# Altium schematic sheet Telemetry.SchDoc
size B; SheetNumber: 4; SheetTotal: 8
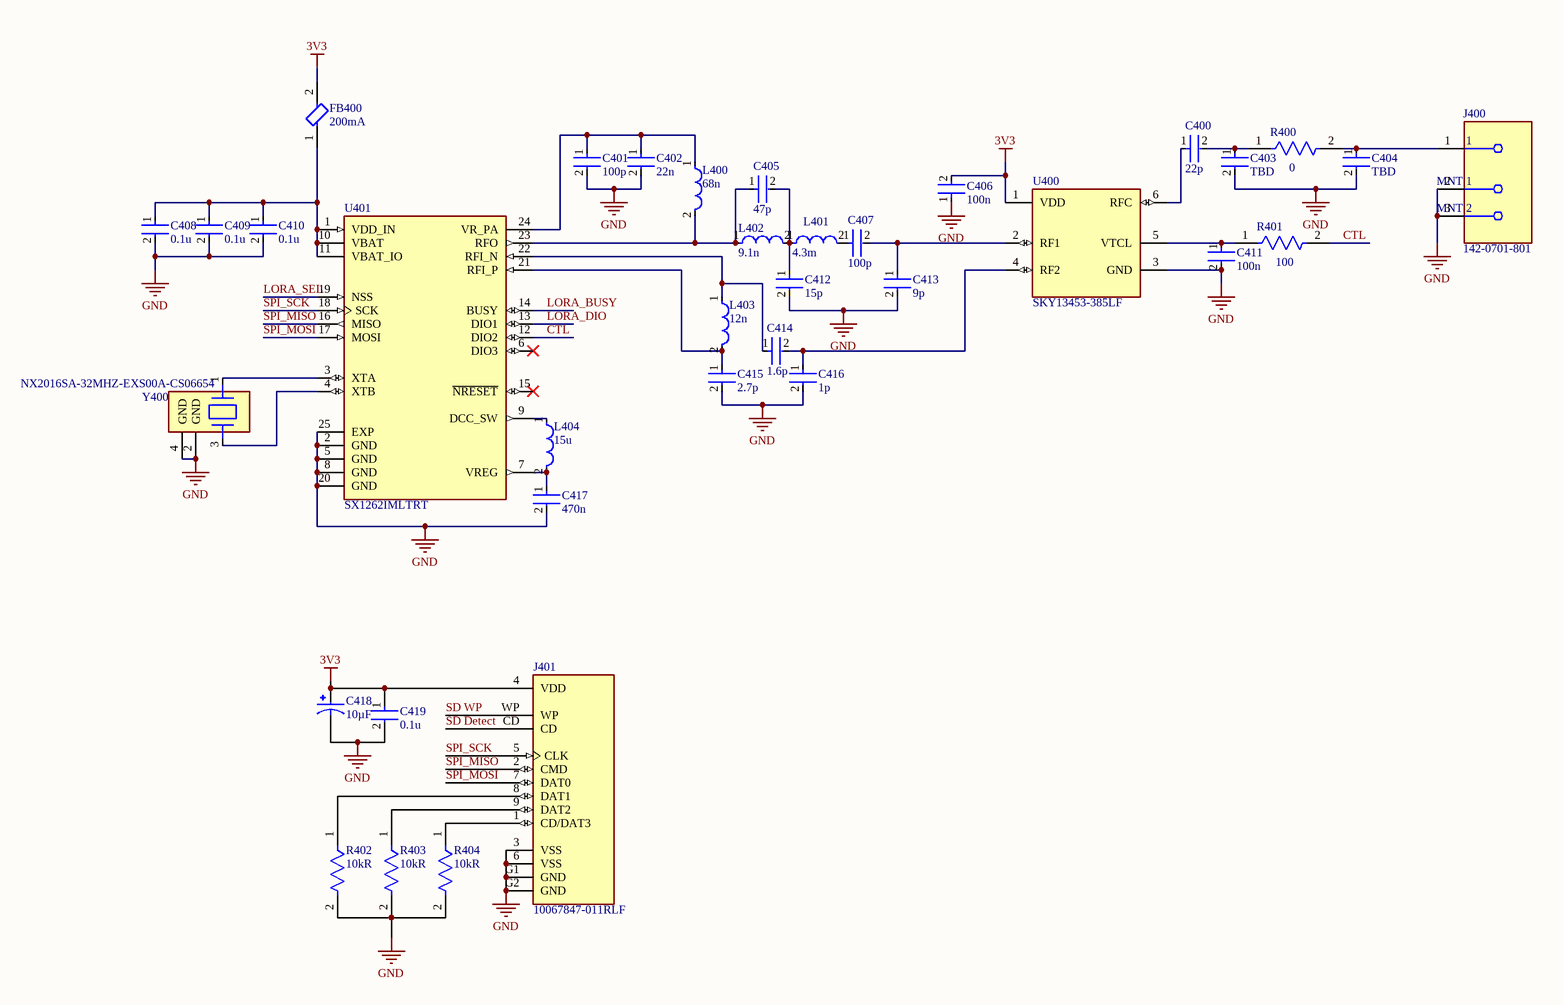
[diagram p0: Telemetry.SchDoc]

## Parts
C400  Capacitance: 22p  [FP-CL10-IPC_A]  (hidden comment: CL10C681JB8NFNC)
C401  Capacitance: 100p  [FP-CL10-IPC_A]  (hidden comment: CL10C681JB8NFNC)
C402  Capacitance: 22n  [FP-CL10-IPC_A]  (hidden comment: CL10C681JB8NFNC)
C403  Capacitance: TBD  [FP-CL10-IPC_A]  (hidden comment: CL10C681JB8NFNC)
C404  Capacitance: TBD  [FP-CL10-IPC_A]  (hidden comment: CL10C681JB8NFNC)
C405  Capacitance: 47p  [FP-CL10-IPC_A]  (hidden comment: CL10C681JB8NFNC)
C406  Capacitance: 100n  [FP-CL10-IPC_A]  (hidden comment: CL10C681JB8NFNC)
C407  Capacitance: 100p  [FP-CL10-IPC_A]  (hidden comment: CL10C681JB8NFNC)
C408  Capacitance: 0.1u  [FP-CL10-IPC_A]  (hidden comment: CL10C681JB8NFNC)
C409  Capacitance: 0.1u  [FP-CL10-IPC_A]  (hidden comment: CL10C681JB8NFNC)
C410  Capacitance: 0.1u  [FP-CL10-IPC_A]  (hidden comment: CL10C681JB8NFNC)
C411  Capacitance: 100n  [FP-CL10-IPC_A]  (hidden comment: CL10C681JB8NFNC)
C412  Capacitance: 15p  [FP-CL10-IPC_A]  (hidden comment: CL10C681JB8NFNC)
C413  Capacitance: 9p  [FP-CL10-IPC_A]  (hidden comment: CL10C681JB8NFNC)
C414  Capacitance: 1.6p  [FP-CL10-IPC_A]  (hidden comment: CL10C681JB8NFNC)
C415  Capacitance: 2.7p  [FP-CL10-IPC_A]  (hidden comment: CL10C681JB8NFNC)
C416  Capacitance: 1p  [FP-CL10-IPC_A]  (hidden comment: CL10C681JB8NFNC)
C417  Capacitance: 470n  [FP-CL10-IPC_A]  (hidden comment: CL10C681JB8NFNC)
C418  value 10µF  [CAP_EEEFN1C100R]  (hidden comment: EEEFN1C100R)
C419  Capacitance: 0.1u  [FP-CL10-IPC_A]  (hidden comment: CL10C681JB8NFNC)
FB400  200mA  [FP-BLM18-0_15-t0_8-IPC_B]
J400  142-0701-801  [FP-142-0701-801-MFG]
J401  10067847-011RLF  [AMPHENOL_10067847-011RLF]
L400  68n  [FP-LQM18NN_00-IPC_B]
L401  4.3m  [FP-LQM18NN_00-IPC_B]
L402  9.1n  [FP-LQM18NN_00-IPC_B]
L403  12n  [FP-LQM18NN_00-IPC_B]
L404  15u  [FP-LQM18NN_00-IPC_B]
R400  value 0  [FP-CPF0603-MFG]  (hidden comment: CPF0603B2K15E1)
R401  value 100  [FP-CPF0603-MFG]  (hidden comment: CPF0603B2K15E1)
R402  value 10kR  [FP-CPF0603-MFG]  (hidden comment: CPF0603B2K15E1)
R403  value 10kR  [FP-CPF0603-MFG]  (hidden comment: CPF0603B2K15E1)
R404  value 10kR  [FP-CPF0603-MFG]  (hidden comment: CPF0603B2K15E1)
U400  SKY13453-385LF  [IC_SKY13453-385LF]
U401  SX1262IMLTRT  [QFN50P400X400X100-25N]
Y400  NX2016SA-32MHZ-EXS00A-CS06654  [FP-NX2016SA-MFG]

## Nets
3V3: C406.2 C418.1 C419.1 FB400.2 J401.4(VDD) U400.1(VDD)
GND: C401.2 C402.2 C403.2 C404.2 C406.1 C408.2 C409.2 C410.2 C411.2 C412.2 C413.2 C415.2 C416.2 C417.2 C418.2 C419.2 J400.2(MNT_1) J400.3(MNT_2) J401.3(VSS) J401.6(VSS) J401.G1(GND) J401.G2(GND) R402.2 R403.2 R404.2 U400.3(GND) U401.2(GND) U401.5(GND) U401.8(GND) U401.20(GND) U401.25(EXP) Y400.2(GND) Y400.4(GND)
CTL: R401.2 U401.12(DIO2)
LORA_BUSY: U401.14(BUSY)
LORA_DIO: U401.13(DIO1)
LORA_SEL: U401.19(NSS)
SD Detect: J401.CD
SD WP: J401.WP
SPI_MISO: J401.2(CMD) U401.16(MISO)
SPI_MOSI: J401.7(DAT0) U401.17(MOSI)
SPI_SCK: J401.5(CLK) U401.18(SCK)
NetC400_1: C400.1 U400.6(RFC)
NetC400_2: C400.2 C403.1 R400.1
NetC401_1: C401.1 C402.1 L400.1 U401.24(VR_PA)
NetC404_1: C404.1 J400.1 R400.2
NetC405_1: C405.1 L400.2 L402.1 U401.23(RFO)
NetC405_2: C405.2 C412.1 L401.1 L402.2
NetC407_1: C407.1 L401.2
NetC407_2: C407.2 C413.1 U400.2(RF1)
NetC408_1: C408.1 C409.1 C410.1 FB400.1 U401.1(VDD_IN) U401.10(VBAT) U401.11(VBAT_IO)
NetC411_1: C411.1 R401.1 U400.5(VTCL)
NetC414_1: C414.1 L403.1 U401.22(RFI_N)
NetC414_2: C414.2 C416.1 U400.4(RF2)
NetC415_1: C415.1 L403.2 U401.21(RFI_P)
NetC417_1: C417.1 L404.2 U401.7(VREG)
NetJ401_1: J401.1(CD/DAT3) R404.1
NetJ401_8: J401.8(DAT1) R402.1
NetJ401_9: J401.9(DAT2) R403.1
NetL404_1: L404.1 U401.9(DCC_SW)
NetU401_3: U401.3(XTA) Y400.1
NetU401_4: U401.4(XTB) Y400.3

Not connected (* = marked no-connect by the designer): U401 6(DIO3)* 15(~{NRESET})*

## Library data of the parts
C400-C417 C419 = CMP-13271-001533-1: Cap Ceramic 680pF 50V C0G ±5% Pad SMD 0603 +125°C T/R; Voltage Rating: 50V; Radiation Hardening: No; Length: 0.063inch; Min Operating Temperature: -55°C; Package Quantity: 1; Lead Free: Lead Free; Case Code (Metric): 1608; Thickness: 0.035inch; Width: 0.031inch; Height: 0.8mm; Case/Package: 0603; Tolerance: 5%; Mount: Surface Mount; Dielectric: C0G; Max Operating Temperature: 125°C; Case Code (Imperial): 0603; Packaging: Tape and Reel; Depth: 0.8mm
C418 = CMP-001-00085-1: 10ÂµF 16V Aluminum Electrolytic Capacitors Radial, Can - SMD 1.35Ohm @ 100kHz 2000 Hrs @ 105Â°C; MF: Panasonic; Digi-Key_Part_Number: 10-EEE-FN1C100RCT-ND; Design Item ID: EEEFN1C100R; Check_prices: https://www.snapeda.com/parts/EEEFN1C100R/Panasonic/view-part/5793981/?ref=eda; MP: EEEFN1C100R; Source: EEEFN1C100R.SchLib; Case/Package: RADIAL-2 Panasonic; Component Type: Standard; Pins: 2; SnapEDA_Link: https://www.snapeda.com/parts/EEEFN1C100R/Panasonic/view-part/5793981/?ref=snap
FB400 = CMP-0686-00463-3: Chip Ferrite Bead, 0603, 120Ω @ 100MHz, 0.4Ω, 25%, 300mA; DC Resistance (DCR): 400mR; Shielding: Unshielded; Impedance: 120R; Number of Lines: 1; Package Quantity: 1; Max Current Rating: 300mA; Case Code (Metric): 1608; REACH SVHC: No SVHC; DC Current: 200mA; Material: Ferrite; Resistor Type: Ferrite Bead; Lead Free: Lead Free; DC Resistance-Max: 400mR; Packaging: Tape and Reel; Case/Package: 0603; Width: 0.8mm; Case Code (Imperial): 0603; Min Operating Temperature: -55°C; Weight: 7.1E-05oz; Max Operating Temperature: 125°C; Series: BLM18B; Max DC Current: 200mA; Termination: SMD/SMT; Length: 1.6mm; Military Standard: Not; Radiation Hardening: No; Depth: 0.8mm; Tolerance: 25%; Height: 0.8mm; Core Material: Ferrite; Test Frequency: 100MHz; Resistance: 400mR; Number of Pins: 2; Current Rating: 200mA; Number of Circuits: 1
J400 = CMP-09588-000002-1: CONN SMA JACK STR 50OHM EDGE MNT; Frequency: 18GHz; Operating Frequency: 0 to 18 GHz; Body Material: Brass; Impedance: 50R; Voltage Rating: 335V; Gender: Female; Body Plating: Gold; Orientation: Straight; Length: 0.44inch; Max Operating Temperature: 165°C; Package Quantity: 5; Packaging: Bulk; Series: SMA; Contact Material: Copper; Min Operating Temperature: -65°C; Depth: 25.58mm; RoHS Compliant: Yes; Case/Package: SMA; Max Frequency: 18GHz; Radiation Hardening: No; Contact Plating: Gold; Mount: Edge; Connector Type: SMA; Fastening Type: Threaded; Termination: Solder
J401 = CMP-073-000000-1: SD card reader Push - Push Type; MF: Amphenol FCI; Pin Count: 13; Design Item ID: 10067847-011RLF; MP: 10067847-011RLF; Purchase-URL: https://pricing.snapeda.com/search?q=10067847-011RLF&ref=eda; SnapEDA_Link: https://www.snapeda.com/parts/10067847-011RLF/Amphenol/view-part/?ref=snap; Availability: In Stock; Source: 10067847-011RLF.SchLib; Check_prices: https://www.snapeda.com/parts/10067847-011RLF/Amphenol/view-part/?ref=eda; Component Type: Standard; Value: *; Package: None; Price: None
L400-L404 = CMP-06042-016758-1: Multilayer Type Inductor for General Circuits, 0603 (1608), 2200nH, 10%, 1.15Ω, 15mA; Inductor Type: MONOLITHIC; DC Resistance (DCR): 1.15R; Shielding: Shielded; Core Material: Ferrite; Inductance: 2.2uH; Test Frequency: 10MHz; Self Resonant Frequency: 50MHz; Q Factor: 35; Width: 0.031inch; Depth: 0.8mm; Series: LQM18N; Length: 1.6mm; Inductance Tolerance: 10%; Packaging: Tape and Reel; Termination: SMD/SMT; Current Rating: 15mA; DC Current: 15mA; Rated Current-Max: 15mA; Case/Package: 0603; Mount: Surface Mount; RoHS Compliant: Yes; Case Code (Imperial): 0603; Min Operating Temperature: -40°C; Max Operating Temperature: 85°C; Military Standard: Not; REACH SVHC: No SVHC; Lead Free: Lead Free; Case Code (Metric): 1608; Tolerance: 10%; Radiation Hardening: No; Number of Pins: 2; Height: 0.8mm; Package Quantity: 1; Height - Seated (Max): 0.035inch; Max DC Current: 15mA
R400-R404 = CMP-03211-008657-1: RES SMD 2.15KΩ 0.1% 1/16W 0603; Manufacturer: TE Connectivity; Temperature Coefficient: 25ppm/°C; Voltage Rating: 50V; Power Rating: 0.063W; Height: 0.55mm; Series: CPF; ComponentLink2Description: Datasheet; Package: CPF0603; Automotive: No; octopart_url: https://octopart.com/cpf0603b2k15e1-te+connectivity-22739551; Lead Free: Yes; Temperature: -55°C to +155°C; RoHS: TRUE; Ipc Land Pattern Name: RESC15580X45; Temperature Range Low: -55°C; Composition: Thin Film; Device Class L3: Chip SMD Resistors; Category: Res; Octopart: https://octopart.com/cpf0603b2k15e1-te+connectivity-22739551; Resistance: 2.15KΩ; ComponentLink2URL: https://www.te.com/commerce/DocumentDelivery/DDEController?Action=showdoc&DocId=Data+Sheet%7F1773200%7FM%7Fpdf%7FEnglish%7FENG_DS_1773200_M.pdf%7F3-1676481-2; Manufacturer Part Number: CPF0603B2K15E1; packaging: 1k Reel; Tolerance: 0.1%; Temperature Range High: +155°C; Device Class L1: Passive Components; Device Class L2: Resistors
U400 = CMP-031-00006-2: RF Switch IC WLAN SPDT 6 GHz 50Ohm 6-QFN (1x1); MF: Skyworks Solutions; SnapEDA_Link: https://www.snapeda.com/parts/SKY13453-385LF/Skyworks+Solutions+Inc./view-part/?ref=snap; Component Type: Standard; Source: SKY13453-385LF.SchLib; Design Item ID: SKY13453-385LF; MP: SKY13453-385LF; Availability: In Stock; Case/Package: None; Purchase-URL: https://pricing.snapeda.com/search/part/SKY13453-385LF/?ref=eda; Value: *; Price: None; Pins: 6; Check_prices: https://www.snapeda.com/parts/SKY13453-385LF/Skyworks+Solutions+Inc./view-part/?ref=eda
U401 = CMP-013-000000-4: IC RF TxRx Only General ISM < 1GHz LoRaWAN 150MHz ~ 960MHz 24-VFQFN Exposed Pad; MF: Semtech Corporation; Availability: Unavailable; Design Item ID: SX1262IMLTRT; Pin Count: 25; Source: SnapEDAsch.SchLib; Value: *; Package: VFQFN-24 Semtech; SnapEDA_Link: https://www.snapeda.com/parts/SX1262IMLTRT/Semtech%20Corporation/view-part/2781045/?ref=snap; Price: None; MP: SX1262IMLTRT; Component Type: Standard
Y400 = CMP-200220-000017-1: CRYSTAL 32.0000MHZ 8PF SMD; Frequency: 32MHz; ESR (Equivalent Series Resistance): 60R; Ratings: AEC-Q200; Mount: Surface Mount; Case/Package: SMD/SMT; Packaging: Tape and Reel; Load Capacitance: 8pF; Min Operating Temperature: -40°C; Max Operating Temperature: 125°C